# Altium schematic sheet FMU IO ports.SchDoc
size A4; Organization: Altium Limited; Address1: L3, 12a Rodborough Rd; Address2: Frenchs Forest; Address3: NSW; Address4: Australia 2086
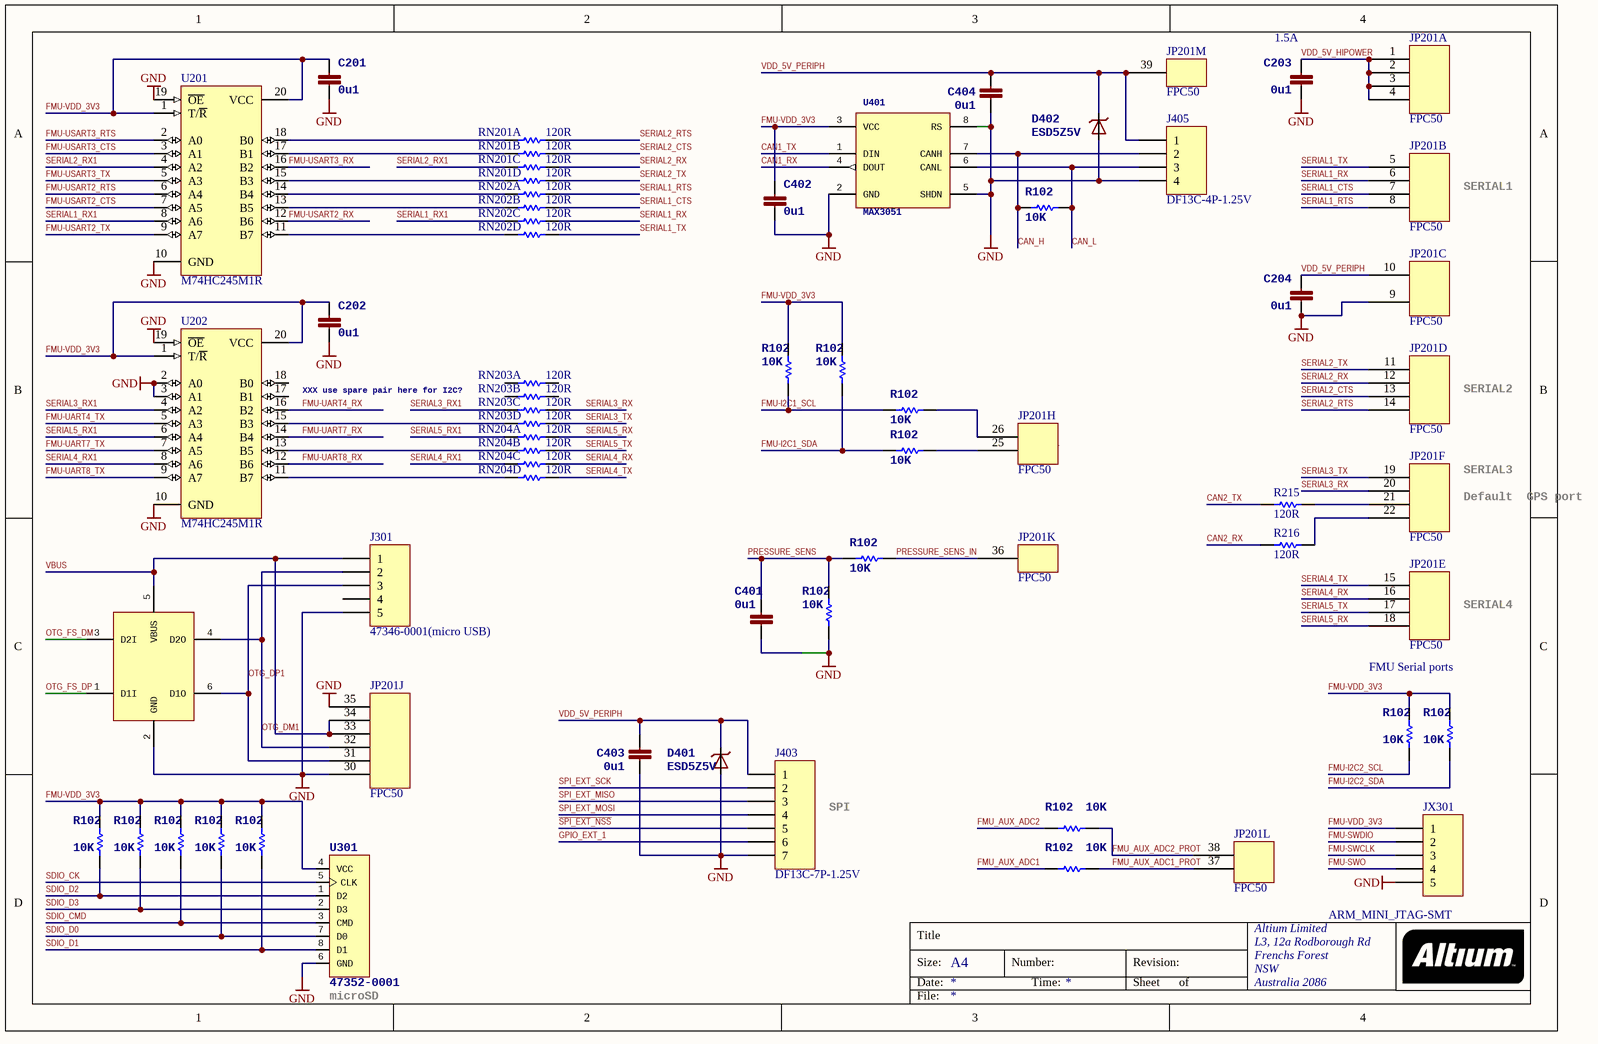
[diagram p0: FMU IO ports.SchDoc]

## Parts
C201  >NAME: C201  [0603-CAP]  (hidden comment: 0u1)
C202  >NAME: C202  [0603-CAP]  (hidden comment: 0u1)
C203  >NAME: C203  [0603-CAP]  (hidden comment: 0u1)
C204  >NAME: C204  [0603-CAP]  (hidden comment: 0u1)
C401  >NAME: C401  [0603-CAP]  (hidden comment: 0u1)
C402  >NAME: C402  [0603-CAP]  (hidden comment: 0u1)
C403  >NAME: C403  [0603-CAP]  (hidden comment: 0u1)
C404  >NAME: C404  [0603-CAP]  (hidden comment: 0u1)
D401  ESD5Z5V  [SOD523]
D402  ESD5Z5V  [SOD523]
J301  47346-0001(micro USB)  [HDR1X5]
J403  DF13C-7P-1.25V  [HDR1X7]
J405  DF13C-4P-1.25V  [HDR1X4]
JP201  FPC50  [FPC-0.5-50下接带锁]  (parts A,B,C,D,E,F,H,J,K,L,M of 16)
JX301  ARM_MINI_JTAG-SMT  [HDR1X5]
R215  value 120R  [AXIAL-0.5]  (hidden comment: Res Semi)
R216  value 120R  [AXIAL-0.5]  (hidden comment: Res Semi)
R301  >NAME: R102  [0603-RES]  (hidden comment: 10K)
R302  >NAME: R102  [0603-RES]  (hidden comment: 10K)
R303  >NAME: R102  [0603-RES]  (hidden comment: 10K)
R304  >NAME: R102  [0603-RES]  (hidden comment: 10K)
R305  >NAME: R102  [0603-RES]  (hidden comment: 10K)
R306  >NAME: R102  [0603-RES]  (hidden comment: 10K)
R307  >NAME: R102  [0603-RES]  (hidden comment: 10K)
R401  >NAME: R102  [0603-RES]  (hidden comment: 10K)
R402  >NAME: R102  [0603-RES]  (hidden comment: 10K)
R403  >NAME: R102  [0603-RES]  (hidden comment: 10K)
R404  >NAME: R102  [0603-RES]  (hidden comment: 10K)
R405  >NAME: R102  [0603-RES]  (hidden comment: 10K)
R406  >NAME: R102  [0603-RES]  (hidden comment: 10K)
R407  >NAME: R102  [0603-RES]  (hidden comment: 10K)
R408  >NAME: R102  [0603-RES]  (hidden comment: 10K)
R409  >NAME: R102  [0603-RES]  (hidden comment: 10K)
RN201A  value 120R  [AXIAL-0.5]  (hidden comment: Res Semi)
RN201B  value 120R  [AXIAL-0.5]  (hidden comment: Res Semi)
RN201C  value 120R  [AXIAL-0.5]  (hidden comment: Res Semi)
RN201D  value 120R  [AXIAL-0.5]  (hidden comment: Res Semi)
RN202A  value 120R  [AXIAL-0.5]  (hidden comment: Res Semi)
RN202B  value 120R  [AXIAL-0.5]  (hidden comment: Res Semi)
RN202C  value 120R  [AXIAL-0.5]  (hidden comment: Res Semi)
RN202D  value 120R  [AXIAL-0.5]  (hidden comment: Res Semi)
RN203A  value 120R  [AXIAL-0.5]  (hidden comment: Res Semi)
RN203B  value 120R  [AXIAL-0.5]  (hidden comment: Res Semi)
RN203C  value 120R  [AXIAL-0.5]  (hidden comment: Res Semi)
RN203D  value 120R  [AXIAL-0.5]  (hidden comment: Res Semi)
RN204A  value 120R  [AXIAL-0.5]  (hidden comment: Res Semi)
RN204B  value 120R  [AXIAL-0.5]  (hidden comment: Res Semi)
RN204C  value 120R  [AXIAL-0.5]  (hidden comment: Res Semi)
RN204D  value 120R  [AXIAL-0.5]  (hidden comment: Res Semi)
U201  M74HC245M1R  [TSSOP20]
U202  M74HC245M1R  [TSSOP20]
U301  >NAME: U301  >VALUE: 47352-0001  [MICROSD]  (hidden comment: 2908-05WB-MG)
U302  NUF2042XV6  [SOT23-6]  (value not drawn)
U401  >NAME: U401  [SOT23-8]  (hidden comment: MAX3051)

## Nets
GND: C201.P$2 C202.P$2 C203.P$2 C204.P$2 C401.P$2 C402.P$2 C403.P$2 C404.P$2 D401.A D402.A J301.5 J403.7 J405.4 JP201.9 JP201.30 JP201.35 JX301.5 R403.P$1 U201.10(GND) U201.19(~{OE}) U202.2(A0) U202.3(A1) U202.10(GND) U202.19(~{OE}) U301.6(GND) U302.2(GND) U401.2(GND) U401.5(SHDN) U401.8(RS)
CAN1_RX: U401.4(DOUT)
CAN1_TX: U401.1(DIN)
CAN2_RX: R216.1
CAN2_TX: R215.1
CAN_H: J405.2 R409.P$1 U401.7(CANH)
CAN_L: J405.3 R409.P$2 U401.6(CANL)
FMU-I2C1_SCL: R401.P$1 R404.P$1
FMU-I2C1_SDA: R402.P$1 R405.P$1
FMU-I2C2_SCL: R306.P$1
FMU-I2C2_SDA: R307.P$1
FMU-SWCLK: JX301.3
FMU-SWDIO: JX301.2
FMU-SWO: JX301.4
FMU-UART4_RX: U202.16(B2)
FMU-UART4_TX: U202.5(A3)
FMU-UART7_RX: U202.14(B4)
FMU-UART7_TX: U202.7(A5)
FMU-UART8_RX: U202.12(B6)
FMU-UART8_TX: U202.9(A7)
FMU-USART2_CTS: U201.7(A5)
FMU-USART2_RTS: U201.6(A4)
FMU-USART2_RX: U201.12(B6)
FMU-USART2_TX: U201.9(A7)
FMU-USART3_CTS: U201.3(A1)
FMU-USART3_RTS: U201.2(A0)
FMU-USART3_RX: U201.16(B2)
FMU-USART3_TX: U201.5(A3)
FMU-VDD_3V3: C201.P$1 C202.P$1 C402.P$1 JX301.1 R301.P$2 R302.P$2 R303.P$2 R304.P$2 R305.P$2 R306.P$2 R307.P$2 R401.P$2 R402.P$2 U201.1(T/~{R}) U201.20(VCC) U202.1(T/~{R}) U202.20(VCC) U301.4(VCC) U401.3(VCC)
FMU_AUX_ADC1: R408.P$1
FMU_AUX_ADC1_PROT: JP201.37 R408.P$2
FMU_AUX_ADC2: R407.P$1
FMU_AUX_ADC2_PROT: JP201.38 R407.P$2
GPIO_EXT_1: J403.6
OTG_DM1: J301.2 JP201.32 U302.4(D2O)
OTG_DP1: J301.3 JP201.31 U302.6(D1O)
OTG_FS_DM: U302.3(D2I)
OTG_FS_DP: U302.1(D1I)
PRESSURE_SENS: C401.P$1 R403.P$2 R406.P$1
PRESSURE_SENS_IN: JP201.36 R406.P$2
~{SPI_EXT_NSS}: J403.5
SDIO_CK: U301.5(CLK)
SDIO_CMD: R303.P$1 U301.3(CMD)
SDIO_D0: R304.P$1 U301.7(D0)
SDIO_D1: R305.P$1 U301.8(D1)
SDIO_D2: R301.P$1 U301.1(D2)
SDIO_D3: R302.P$1 U301.2(D3)
SERIAL1_CTS: JP201.7 RN202B.1
SERIAL1_RTS: JP201.8 RN202A.1
SERIAL1_RX: JP201.6 RN202C.1
SERIAL1_RX1: RN202C.2 U201.8(A6)
SERIAL1_TX: JP201.5 RN202D.1
SERIAL2_CTS: JP201.13 RN201B.1
SERIAL2_RTS: JP201.14 RN201A.1
SERIAL2_RX: JP201.12 RN201C.1
SERIAL2_RX1: RN201C.2 U201.4(A2)
SERIAL2_TX: JP201.11 RN201D.1
SERIAL3_RX: JP201.20 RN203C.1
SERIAL3_RX1: RN203C.2 U202.4(A2)
SERIAL3_TX: JP201.19 RN203D.1
SERIAL4_RX: JP201.16 RN204C.1
SERIAL4_RX1: RN204C.2 U202.8(A6)
SERIAL4_TX: JP201.15 RN204D.1
SERIAL5_RX: JP201.18 RN204A.1
SERIAL5_RX1: RN204A.2 U202.6(A4)
SERIAL5_TX: JP201.17 RN204B.1
SPI_EXT_MISO: J403.3
SPI_EXT_MOSI: J403.4
SPI_EXT_SCK: J403.2
VBUS: J301.1 JP201.33 JP201.34 U302.5(VBUS)
VDD_5V_HIPOWER: C203.P$1 JP201.1 JP201.2 JP201.3 JP201.4
VDD_5V_PERIPH: C204.P$1 C403.P$1 C404.P$1 D401.C D402.C J403.1 J405.1 JP201.10 JP201.39
NetJP201_21: JP201.21 R215.2
NetJP201_22: JP201.22 R216.2
NetJP201_25: JP201.25 R405.P$2
NetJP201_26: JP201.26 R404.P$2
NetRN201A_2: RN201A.2 U201.18(B0)
NetRN201B_2: RN201B.2 U201.17(B1)
NetRN201D_2: RN201D.2 U201.15(B3)
NetRN202A_2: RN202A.2 U201.14(B4)
NetRN202B_2: RN202B.2 U201.13(B5)
NetRN202D_2: RN202D.2 U201.11(B7)
NetRN203D_2: RN203D.2 U202.15(B3)
NetRN204B_2: RN204B.2 U202.13(B5)
NetRN204D_2: RN204D.2 U202.11(B7)

Not connected (* = marked no-connect by the designer): J301 4; RN203A 1 2; RN203B 1 2; U202 17(B1) 18(B0)

## Notes on the sheet
- (near C203) 1.5A
- SERIAL1
- XXX use spare pair here for I2C?
- (near JP201) I2C1
- SERIAL2
- SERIAL3
- Default
  GPS port
- SERIAL4
- FMU Serial ports
- SPI
- (near U301) microSD
- Title
- Size:
- Date:
- A4
- Number:
- Time:
- Revision:
- Sheet
- of
- File:

## Library data of the parts
C201 C202 C401 C402 = CAP0402: <b>Capacitor</b> / Standard 0603 ceramic capacitor, and 0.1" leaded capacitor.; PARTNO: CC0402ZRY5V7BB104; >VALUE: 0u1
C203 C204 C403 C404 = CAP0805: <b>Capacitor</b> / Standard 0603 ceramic capacitor, and 0.1" leaded capacitor.; PARTNO: CC0805ZKY5V6BB106; >VALUE: 0u1
D401 D402 = DIODE-TVS
J301 JX301 = Header 5: Header, 5-Pin; LatestRevisionDate: 17-Jul-2002; LatestRevisionNote: Re-released for DXP Platform.; Publisher: Altium Limited
J403 = Header 7: Header, 7-Pin; LatestRevisionDate: 17-Jul-2002; LatestRevisionNote: Re-released for DXP Platform.; Publisher: Altium Limited
J405 = Header 4: Header, 4-Pin; LatestRevisionDate: 17-Jul-2002; LatestRevisionNote: Re-released for DXP Platform.; Publisher: Altium Limited
R215 R216 RN201A RN201B RN201C RN201D RN202A RN202B RN202C RN202D RN203A RN203B RN203C RN203D RN204A RN204B RN204C RN204D = Res Semi: Semiconductor Resistor; Published: 8-Jun-2000; LatestRevisionDate: 17-Jul-2002; LatestRevisionNote: Re-released for DXP Platform.; PackageReference: AXIAL-0.5; Publisher: Altium Limited; PackageDescription: Axial Device, Thru-Hole; 2 Leads; 0.5 in Pin Spacing
R301-R307 R401-R409 = RESISTOR0402-RES: <b>Resistor</b> / Basic schematic elements and footprints for 0603, 1206, and PTH 1/10th watt (small) resistors.; PARTNO: RC0402FR-0710KL; >VALUE: 10K
U201 U202 = M74HC245M1R: Octal Bus Transceiver 3-State Non-Inverting; Published: 8-Jun-2000; LatestRevisionDate: 13-Apr-2006; LatestRevisionNote: IPC-7351 Footprint Added.; DatasheetVersion: Oct-1993; PackageVersion: Jul-2001; PackageReference: SO20; Publisher: Altium Limited; PackageDescription: 20-Pin Plastic Small Outline Integrated Circuit 1.27 mm Pitch; Code_JEDEC: MS-013-AC; Code_IPC: SOIC127P1030-20; ComponentLink1Description: Manufacturer Link; ComponentLink1URL: http://www.st.com/; ComponentLink2Description: Datasheet; ComponentLink2URL: http://www.st.com/stonline/products/literature/ds/1930/m74hc245.pdf
U301 = MICROSDSDI: PARTNO: 2908-05WB-MG
U302 = NUF2042XV6: PARTNO: NUF2042XV6T1G
U401 = MAX3051MAX3051EKA: 3.3-V CAN TRANSCEIVER; PARTNO: MAX3051EKA; >VALUE: MAX3051